# Altium schematic sheet leds.SchDoc: LEDs
size A4; SheetNumber: 3; SheetTotal: 3
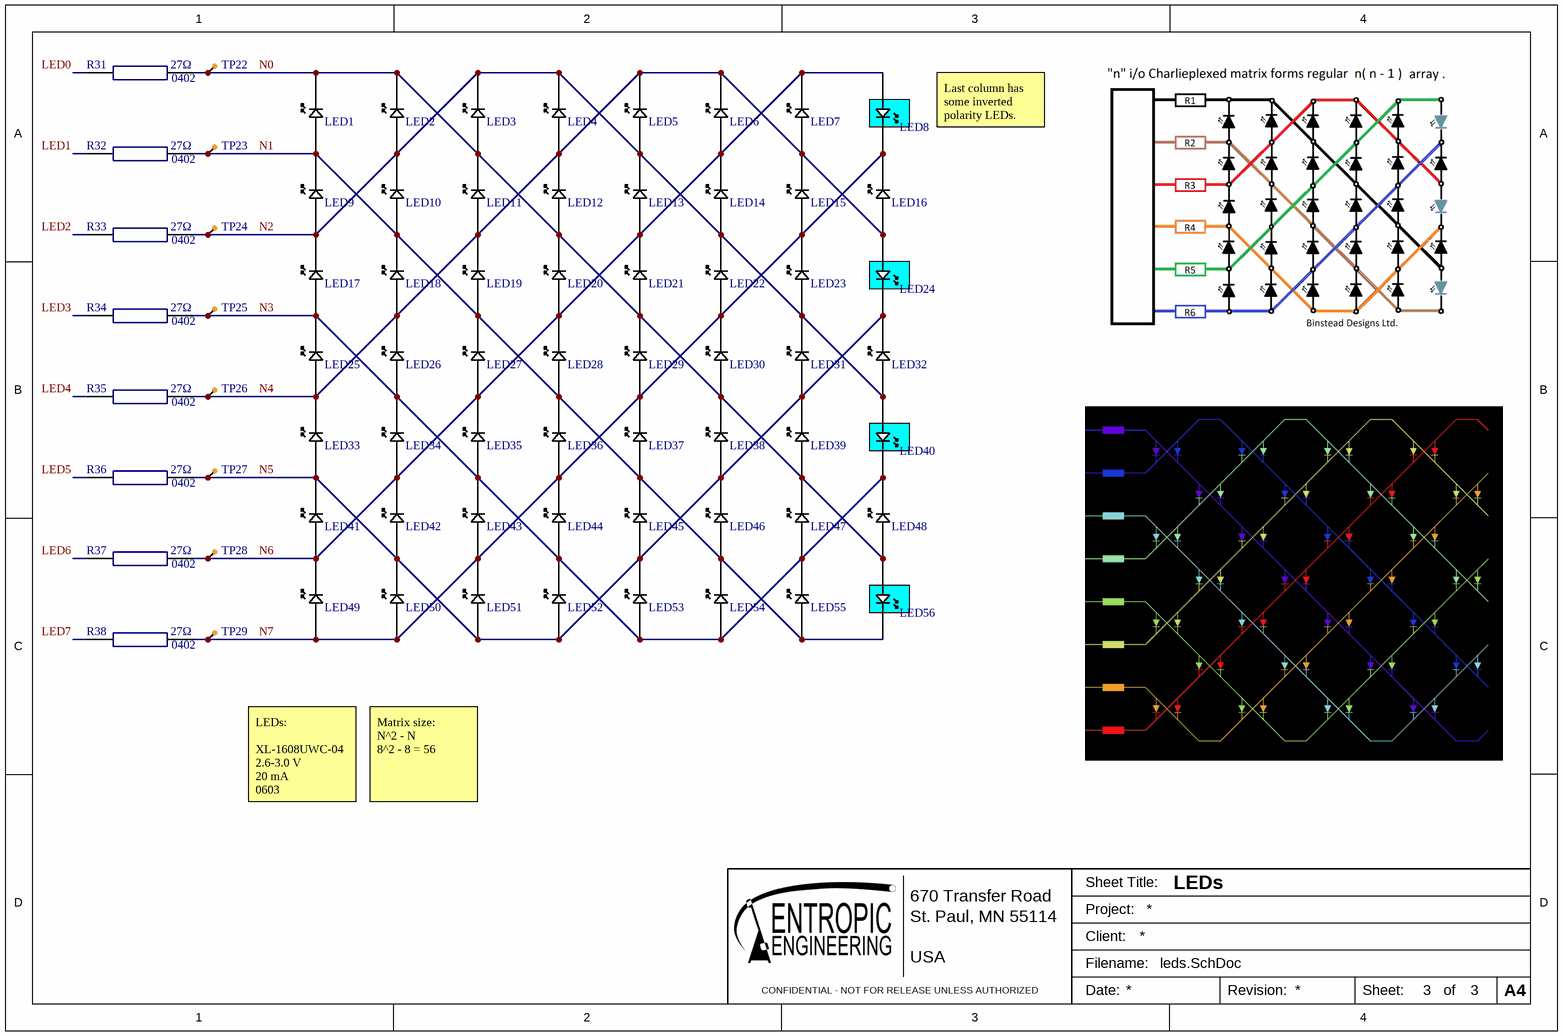
[diagram p0: leds.SchDoc]

## Parts
LED1  XL-1608UWC-04  [0603_LED]  (value not drawn)
LED2  XL-1608UWC-04  [0603_LED]  (value not drawn)
LED3  XL-1608UWC-04  [0603_LED]  (value not drawn)
LED4  XL-1608UWC-04  [0603_LED]  (value not drawn)
LED5  XL-1608UWC-04  [0603_LED]  (value not drawn)
LED6  XL-1608UWC-04  [0603_LED]  (value not drawn)
LED7  XL-1608UWC-04  [0603_LED]  (value not drawn)
LED8  XL-1608UWC-04  [0603_LED]  (value not drawn)
LED9  XL-1608UWC-04  [0603_LED]  (value not drawn)
LED10  XL-1608UWC-04  [0603_LED]  (value not drawn)
LED11  XL-1608UWC-04  [0603_LED]  (value not drawn)
LED12  XL-1608UWC-04  [0603_LED]  (value not drawn)
LED13  XL-1608UWC-04  [0603_LED]  (value not drawn)
LED14  XL-1608UWC-04  [0603_LED]  (value not drawn)
LED15  XL-1608UWC-04  [0603_LED]  (value not drawn)
LED16  XL-1608UWC-04  [0603_LED]  (value not drawn)
LED17  XL-1608UWC-04  [0603_LED]  (value not drawn)
LED18  XL-1608UWC-04  [0603_LED]  (value not drawn)
LED19  XL-1608UWC-04  [0603_LED]  (value not drawn)
LED20  XL-1608UWC-04  [0603_LED]  (value not drawn)
LED21  XL-1608UWC-04  [0603_LED]  (value not drawn)
LED22  XL-1608UWC-04  [0603_LED]  (value not drawn)
LED23  XL-1608UWC-04  [0603_LED]  (value not drawn)
LED24  XL-1608UWC-04  [0603_LED]  (value not drawn)
LED25  XL-1608UWC-04  [0603_LED]  (value not drawn)
LED26  XL-1608UWC-04  [0603_LED]  (value not drawn)
LED27  XL-1608UWC-04  [0603_LED]  (value not drawn)
LED28  XL-1608UWC-04  [0603_LED]  (value not drawn)
LED29  XL-1608UWC-04  [0603_LED]  (value not drawn)
LED30  XL-1608UWC-04  [0603_LED]  (value not drawn)
LED31  XL-1608UWC-04  [0603_LED]  (value not drawn)
LED32  XL-1608UWC-04  [0603_LED]  (value not drawn)
LED33  XL-1608UWC-04  [0603_LED]  (value not drawn)
LED34  XL-1608UWC-04  [0603_LED]  (value not drawn)
LED35  XL-1608UWC-04  [0603_LED]  (value not drawn)
LED36  XL-1608UWC-04  [0603_LED]  (value not drawn)
LED37  XL-1608UWC-04  [0603_LED]  (value not drawn)
LED38  XL-1608UWC-04  [0603_LED]  (value not drawn)
LED39  XL-1608UWC-04  [0603_LED]  (value not drawn)
LED40  XL-1608UWC-04  [0603_LED]  (value not drawn)
LED41  XL-1608UWC-04  [0603_LED]  (value not drawn)
LED42  XL-1608UWC-04  [0603_LED]  (value not drawn)
LED43  XL-1608UWC-04  [0603_LED]  (value not drawn)
LED44  XL-1608UWC-04  [0603_LED]  (value not drawn)
LED45  XL-1608UWC-04  [0603_LED]  (value not drawn)
LED46  XL-1608UWC-04  [0603_LED]  (value not drawn)
LED47  XL-1608UWC-04  [0603_LED]  (value not drawn)
LED48  XL-1608UWC-04  [0603_LED]  (value not drawn)
LED49  XL-1608UWC-04  [0603_LED]  (value not drawn)
LED50  XL-1608UWC-04  [0603_LED]  (value not drawn)
LED51  XL-1608UWC-04  [0603_LED]  (value not drawn)
LED52  XL-1608UWC-04  [0603_LED]  (value not drawn)
LED53  XL-1608UWC-04  [0603_LED]  (value not drawn)
LED54  XL-1608UWC-04  [0603_LED]  (value not drawn)
LED55  XL-1608UWC-04  [0603_LED]  (value not drawn)
LED56  XL-1608UWC-04  [0603_LED]  (value not drawn)
R31  Resistance: 27Ω  Size Code: 0402  [0402_resistor]  (hidden comment: RMCF0402FT27R0)
R32  Resistance: 27Ω  Size Code: 0402  [0402_resistor]  (hidden comment: RMCF0402FT27R0)
R33  Resistance: 27Ω  Size Code: 0402  [0402_resistor]  (hidden comment: RMCF0402FT27R0)
R34  Resistance: 27Ω  Size Code: 0402  [0402_resistor]  (hidden comment: RMCF0402FT27R0)
R35  Resistance: 27Ω  Size Code: 0402  [0402_resistor]  (hidden comment: RMCF0402FT27R0)
R36  Resistance: 27Ω  Size Code: 0402  [0402_resistor]  (hidden comment: RMCF0402FT27R0)
R37  Resistance: 27Ω  Size Code: 0402  [0402_resistor]  (hidden comment: RMCF0402FT27R0)
R38  Resistance: 27Ω  Size Code: 0402  [0402_resistor]  (hidden comment: RMCF0402FT27R0)
TP22  test_point-1  [test_point-1]  (value not drawn)  (no BOM)
TP23  test_point-1  [test_point-1]  (value not drawn)  (no BOM)
TP24  test_point-1  [test_point-1]  (value not drawn)  (no BOM)
TP25  test_point-1  [test_point-1]  (value not drawn)  (no BOM)
TP26  test_point-1  [test_point-1]  (value not drawn)  (no BOM)
TP27  test_point-1  [test_point-1]  (value not drawn)  (no BOM)
TP28  test_point-1  [test_point-1]  (value not drawn)  (no BOM)
TP29  test_point-1  [test_point-1]  (value not drawn)  (no BOM)

## Nets
LED0: R31.2
LED1: R32.2
LED2: R33.2
LED3: R34.2
LED4: R35.2
LED5: R36.2
LED6: R37.2
LED7: R38.2
N0: LED1.2(K) LED2.2(K) LED3.1(A) LED11.2(K) LED12.1(A) LED20.2(K) LED21.1(A) LED29.2(K) LED30.1(A) LED38.2(K) LED39.1(A) LED47.2(K) LED48.1(A) LED56.1(A) R31.1 TP22.1
N1: LED1.1(A) LED9.2(K) LED10.1(A) LED18.2(K) LED19.1(A) LED27.2(K) LED28.1(A) LED36.2(K) LED37.1(A) LED45.2(K) LED46.1(A) LED54.2(K) LED55.1(A) LED56.2(K) R32.1 TP23.1
N2: LED2.1(A) LED3.2(K) LED4.2(K) LED5.1(A) LED9.1(A) LED10.2(K) LED13.2(K) LED14.1(A) LED17.2(K) LED22.2(K) LED23.1(A) LED31.2(K) LED32.1(A) LED40.1(A) R33.1 TP24.1
N3: LED17.1(A) LED25.2(K) LED26.1(A) LED34.2(K) LED35.1(A) LED40.2(K) LED43.2(K) LED44.1(A) LED47.1(A) LED48.2(K) LED52.2(K) LED53.1(A) LED54.1(A) LED55.2(K) R34.1 TP25.1
N4: LED4.1(A) LED5.2(K) LED6.2(K) LED7.1(A) LED11.1(A) LED12.2(K) LED15.2(K) LED16.1(A) LED18.1(A) LED19.2(K) LED24.1(A) LED25.1(A) LED26.2(K) LED33.2(K) R35.1 TP26.1
N5: LED24.2(K) LED31.1(A) LED32.2(K) LED33.1(A) LED38.1(A) LED39.2(K) LED41.2(K) LED42.1(A) LED45.1(A) LED46.2(K) LED50.2(K) LED51.1(A) LED52.1(A) LED53.2(K) R36.1 TP27.1
N6: LED6.1(A) LED7.2(K) LED8.1(A) LED13.1(A) LED14.2(K) LED20.1(A) LED21.2(K) LED27.1(A) LED28.2(K) LED34.1(A) LED35.2(K) LED41.1(A) LED42.2(K) LED49.2(K) R37.1 TP28.1
N7: LED8.2(K) LED15.1(A) LED16.2(K) LED22.1(A) LED23.2(K) LED29.1(A) LED30.2(K) LED36.1(A) LED37.2(K) LED43.1(A) LED44.2(K) LED49.1(A) LED50.1(A) LED51.2(K) R38.1 TP29.1

## Notes on the sheet
- Last column has some inverted polarity LEDs.
- LEDs:
  XL-1608UWC-04
  2.6-3.0 V
  20 mA
  0603
- Matrix size:
  N^2 - N
  8^2 - 8 = 56
- 670 Transfer Road
- St. Paul, MN 55114
- Sheet Title:
- Project:
- CONFIDENTIAL - NOT FOR RELEASE UNLESS AUTHORIZED
- USA
- Client:
- Filename:
- Date:
- Revision:
- Sheet:
- of
- A4

## Library data of the parts
LED1-LED56 = XL-1608UWC-04: White LED, 0603; Manufacturer: XINGLIGHT; Current: 20mA; Forward Voltage: 2.7V; Supplier 1: LCSC; RoHS: No; Stock 1: 792847; Pricing 1: 100=0.0038, 1000=0.0031, 4000=0.0024, 8000=0.0022, 48000=0.002 (USD); Supplier Part Number 1: C965808; Package: 0603; Manufacturer Part Number: XL-1608UWC-04
R31-R38 = RMCF0402FT27R0: 27 Ω, 0402 Chip resistor; Manufacturer: Stackpole Electronics; house_part_number: R-27-0402-1%-001; Tolerance: 1%; Rated Power Dissipation (P): 63mW; Rated Temperature: 70°C; Temperature Coefficient: 100ppm/°C; Working Voltage: 50V; Package Height: 0.3mm; Package Length: 1mm; Package Width: 0.5mm; Reference Standard: AEC-Q200; Supplier 1: Digi-Key; Supplier Part Number 1: RMCF0402FT27R0CT-ND; RoHS: Yes; Category: Chip SMD Resistors; Stock 1: 3710; Pricing 1: 1=0.10000, 10=0.01500, 100=0.00610, 1000=0.00274, 2500=0.00238, 5000=0.00197 (USD); Mount: Surface Mount; Number of Pins: 2; Package Shape: Rectangular; Terminal Finish: Nickel; Min Operating Temperature: -55°C; Max Operating Temperature: 155°C; JESD-609 Code: e3; Resistor Type: FIXED RESISTOR; Construction: Rectangular; Package Style: SMTMeter; Packaging: Tape and Reel; Technology: METAL GLAZE/THICK FILM; Termination: Wraparound; REACH SVHC: Yes; RoHS Compliant: Yes; ComponentLink1URL: https://datasheet.ciiva.com:443/pdfs/VipMasterIC/IC/SEIE/SEIE-S-A0009541969/SEIE-S-A0009541969-1.pdf?src-supplier=IHS+Markit; ComponentLink1Description: https://datasheet.ciiva.com:443/pdfs/VipMasterIC/IC/SEIE/SEIE-S-A0009541969/SEIE-S-A0009541969-1.pdf?src-supplier=IHS+Markit; ComponentLink2URL: https://www.seielect.com/catalog/SEI-RMCF_RMCP.pdf?src-supplier=Avnet; ComponentLink2Description: https://www.seielect.com/catalog/SEI-RMCF_RMCP.pdf?src-supplier=Avnet; ComponentLink3URL: https://www.seielect.com/catalog/sei-rmcf_rmcp.pdf?src-supplier=Digi-Key; ComponentLink3Description: https://www.seielect.com/catalog/sei-rmcf_rmcp.pdf?src-supplier=Digi-Key; ComponentLink4URL: http://www.seielect.com/Catalog/SEI-RMCF_RMCP.pdf?src-supplier=Digi-Key; ComponentLink4Description: http://www.seielect.com/Catalog/SEI-RMCF_RMCP.pdf?src-supplier=Digi-Key; Manufacturer Part Number: RMCF0402FT27R0
TP22-TP29 = test_point-1: Test point; pickable: no